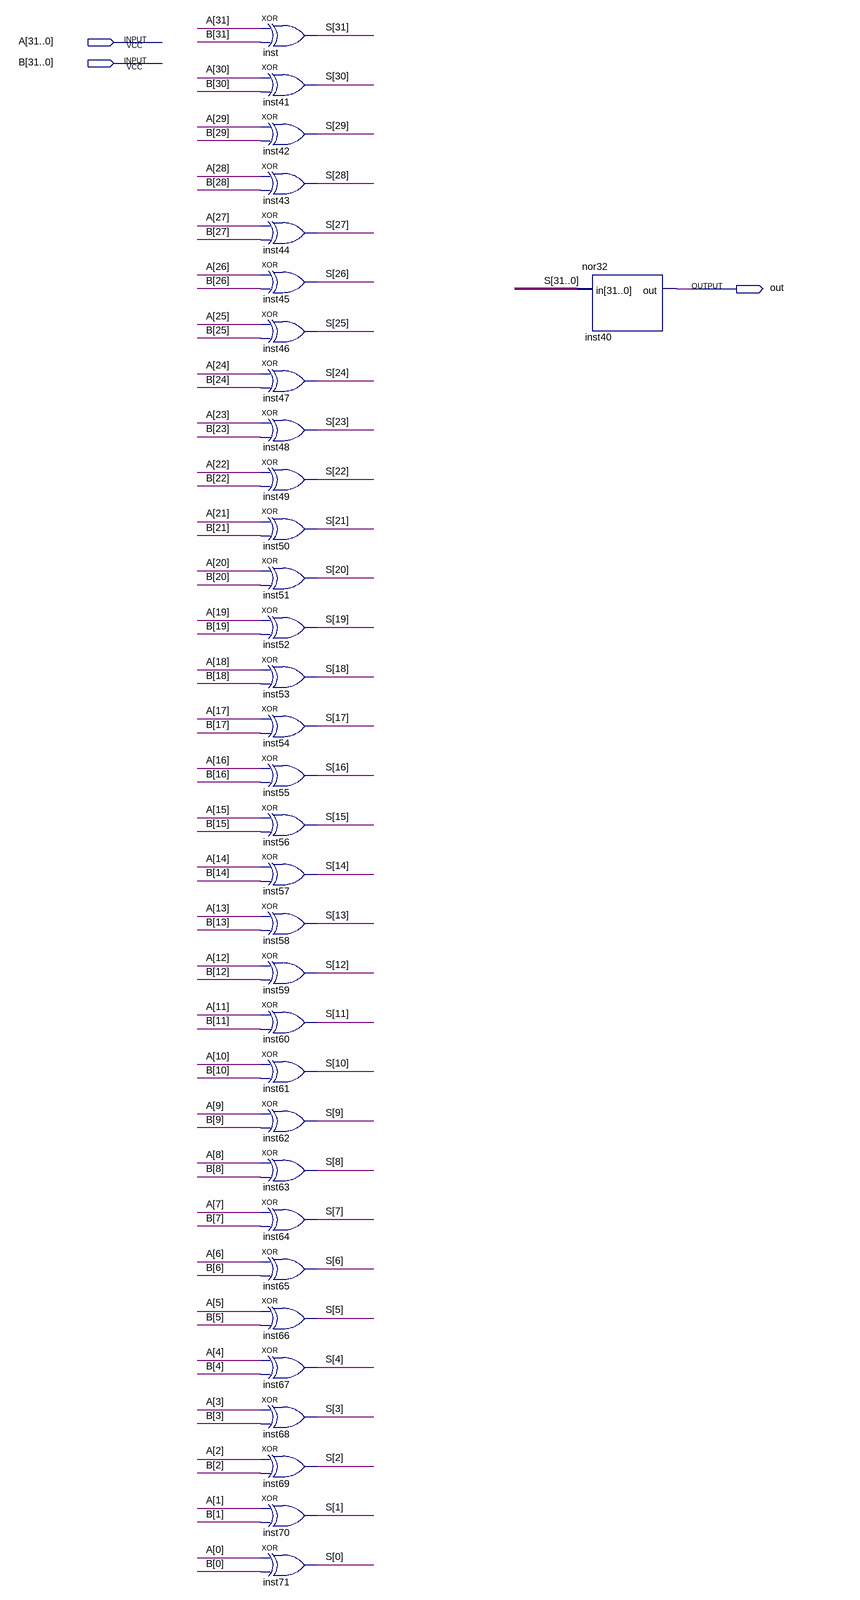
[diagram p0: schematic sheet]
// Quartus schematic Equal.bdf as structural Verilog: 33 symbols, 3 pins
module Equal (
  input  [31:0] A,
  input  [31:0] B,
  output out
);

  wire [31:0] S;

  xor inst (S[31], A[31], B[31]);
  xor inst41 (S[30], A[30], B[30]);
  xor inst42 (S[29], A[29], B[29]);
  xor inst43 (S[28], A[28], B[28]);
  xor inst44 (S[27], A[27], B[27]);
  xor inst45 (S[26], A[26], B[26]);
  xor inst46 (S[25], A[25], B[25]);
  xor inst47 (S[24], A[24], B[24]);
  xor inst48 (S[23], A[23], B[23]);
  xor inst49 (S[22], A[22], B[22]);
  xor inst50 (S[21], A[21], B[21]);
  xor inst51 (S[20], A[20], B[20]);
  xor inst52 (S[19], A[19], B[19]);
  xor inst53 (S[18], A[18], B[18]);
  xor inst54 (S[17], A[17], B[17]);
  xor inst55 (S[16], A[16], B[16]);
  xor inst56 (S[15], A[15], B[15]);
  xor inst57 (S[14], A[14], B[14]);
  xor inst58 (S[13], A[13], B[13]);
  xor inst59 (S[12], A[12], B[12]);
  xor inst60 (S[11], A[11], B[11]);
  xor inst61 (S[10], A[10], B[10]);
  xor inst62 (S[9], A[9], B[9]);
  xor inst63 (S[8], A[8], B[8]);
  xor inst64 (S[7], A[7], B[7]);
  xor inst65 (S[6], A[6], B[6]);
  xor inst66 (S[5], A[5], B[5]);
  xor inst67 (S[4], A[4], B[4]);
  xor inst68 (S[3], A[3], B[3]);
  xor inst69 (S[2], A[2], B[2]);
  xor inst70 (S[1], A[1], B[1]);
  xor inst71 (S[0], A[0], B[0]);
  nor32 inst40 (.in(S), .out(out));
endmodule
